# EAGLE design pH (EAGLE 9.5.0)
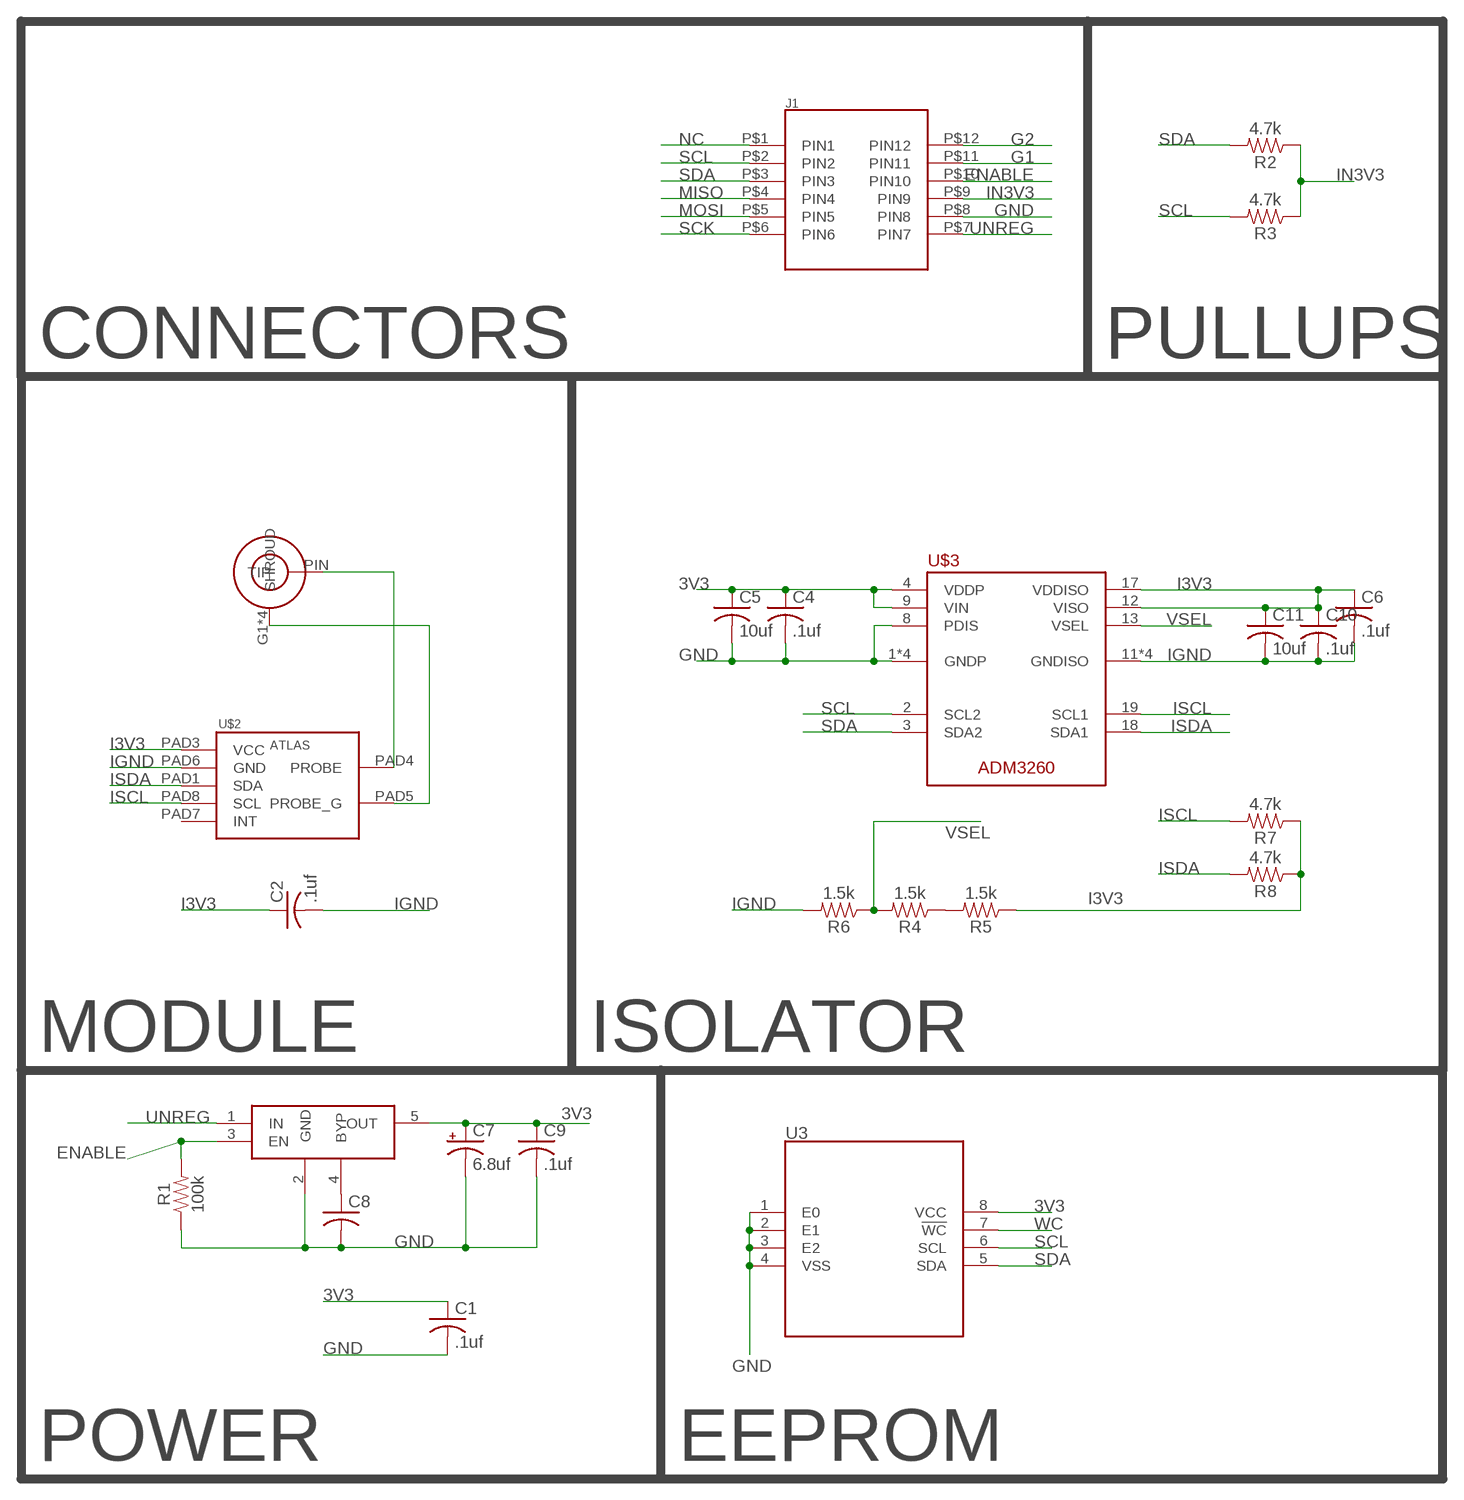
[diagram p0: schematic, sheet 1]

## Parts
C1  .1uf  C-USC0603K  [C0603K]
C2  .1uf  C-USC0603K  [C0603K]
C4  .1uf  C-USC0603K  [C0603K]
C5  10uf  C-USC0603K  [C0603K]
C6  .1uf  C-USC0603K  [C0603K]
C7  6.8uf  CPOL-USA/3216-18R  [A/3216-18R]
C8  C-USC0603K  [C0603K]
C9  .1uf  C-USC0603K  [C0603K]
C10  .1uf  C-USC0603K  [C0603K]
C11  10uf  C-USC0603K  [C0603K]
J1  2X6-HEADERS  [M20-7810645]
R1  100k  100KOHM-0603-1/10W-1%  [0603]
R2  4.7k  100KOHM-0603-1/10W-1%  [0603]
R3  4.7k  100KOHM-0603-1/10W-1%  [0603]
R4  1.5k  100KOHM-0603-1/10W-1%  [0603]
R5  1.5k  100KOHM-0603-1/10W-1%  [0603]
R6  1.5k  100KOHM-0603-1/10W-1%  [0603]
R7  4.7k  100KOHM-0603-1/10W-1%  [0603]
R8  4.7k  100KOHM-0603-1/10W-1%  [0603]
U3  M24C02-WMN6TP  [SOIC127P600X175-8]
U$1  5-1814832-1  [5-1814832-1]
U$2  ATLAS10P  [ATLAS-10P]
U$3  ADM3260  [SOP65P780X200-20]
U$4  MIC5219-3.3YM5-TR  [SOT95P280X145-5]

## Nets
3V3: C1.1 C4.1 C5.1 C7.+ C9.1 U3.8(VCC) U$3.4(VDDP) U$3.9(VIN) U$4.5(OUT)
ENABLE: J1.P$10(PIN10) R1.2 U$4.3(EN)
G1: J1.P$11(PIN11)
G2: J1.P$12(PIN12)
GND: C1.2 C4.2 C5.2 C7.- C8.2 C9.2 J1.P$8(PIN8) R1.1 U3.1(E0) U3.2(E1) U3.3(E2) U3.4(VSS) U$3.1(GNDP) U$3.5(GNDP) U$3.7(GNDP) U$3.8(PDIS) U$3.10(GNDP) U$4.2(GND)
I3V3: C2.1 C6.1 C10.1 C11.1 R5.1 R7.1 R8.1 U$2.PAD3(VCC) U$3.12(VISO) U$3.17(VDDISO)
IGND: C2.2 C6.2 C10.2 C11.2 R6.2 U$2.PAD6(GND) U$3.11(GNDISO) U$3.14(GNDISO) U$3.16(GNDISO) U$3.20(GNDISO)
IN3V3: J1.P$9(PIN9) R2.1 R3.1
ISCL: R7.2 U$2.PAD8(SCL) U$3.19(SCL1)
ISDA: R8.2 U$2.PAD1(SDA) U$3.18(SDA1)
MISO: J1.P$4(PIN4)
MOSI: J1.P$5(PIN5)
N$2: U$1.PIN(TIP) U$2.PAD4(PROBE)
N$3: R4.1 R5.2
N$6: C8.1 U$4.4(BYP)
NC: J1.P$1(PIN1)
PG: U$1.G1(SHROUD) U$1.G2(SHROUD) U$1.G3(SHROUD) U$1.G4(SHROUD) U$2.PAD5(PROBE_G)
SCK: J1.P$6(PIN6)
SCL: J1.P$2(PIN2) R3.2 U3.6(SCL) U$3.2(SCL2)
SDA: J1.P$3(PIN3) R2.2 U3.5(SDA) U$3.3(SDA2)
UNREG: J1.P$7(PIN7) U$4.1(IN)
VSEL: R4.2 R6.1 U$3.13(VSEL)
WC: U3.7(!WC)
Unconnected: U$2.PAD7(INT)

## Notes on the sheet
- CONNECTORS | PULLUPS
- MODULE | ISOLATOR
- POWER | EEPROM

## Library data of the parts
C1 C2 C4-C6 C8-C11 = rcl:C-US: CAPACITOR, American symbol; SPICEPREFIX: C
C7 = rcl:CPOL-US: POLARIZED CAPACITOR, American symbol; SPICEPREFIX: C
J1 = Conservify:2X6-HEADERS
R1 = SparkFun-Resistors:100KOHM: 100kΩ resistor A resistor is a passive two-terminal electrical component that implements electrical resistance as a circuit element. Resistors act to reduce current flow, and, at the same time, act to lower voltage levels within circuits. - Wikipedia; PROD_ID: RES-07828
R2-R8 = SparkFun-Resistors:100KOHM: 100kΩ resistor A resistor is a passive two-terminal electrical component that implements electrical resistance as a circuit element. Resistors act to reduce current flow, and, at the same time, act to lower voltage levels within circuits. - Wikipedia; PROD_ID: RES-07828; VALUE: 100k
U3 = Conservify:M24C02-WMN6TP
U$1 = Conservify:5-1814832-1
U$2 = Conservify:ATLAS10P
U$3 = Conservify:ADM3260
U$4 = Conservify:MIC5219-3.3YM5-TR

## Board
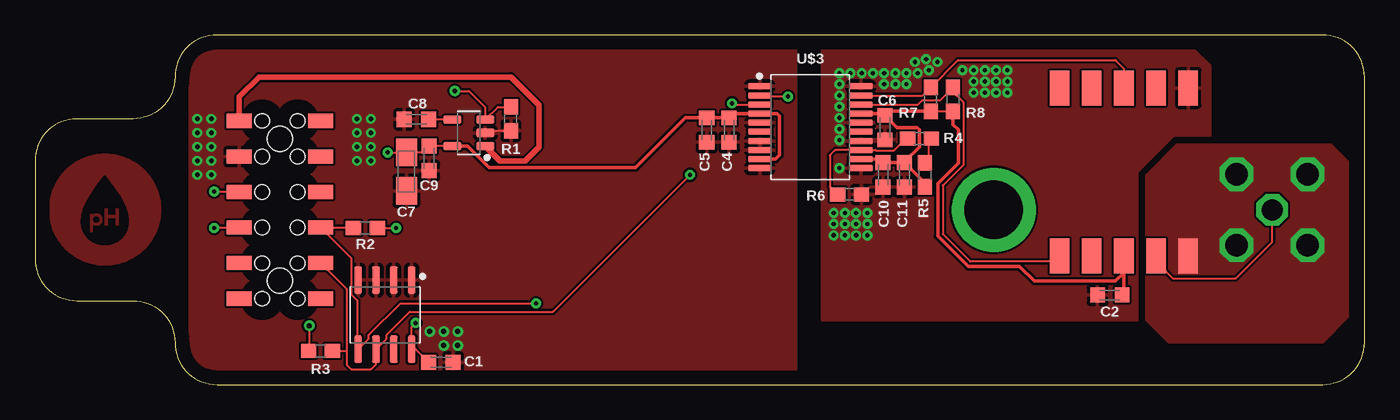
[diagram p1: board, top side]
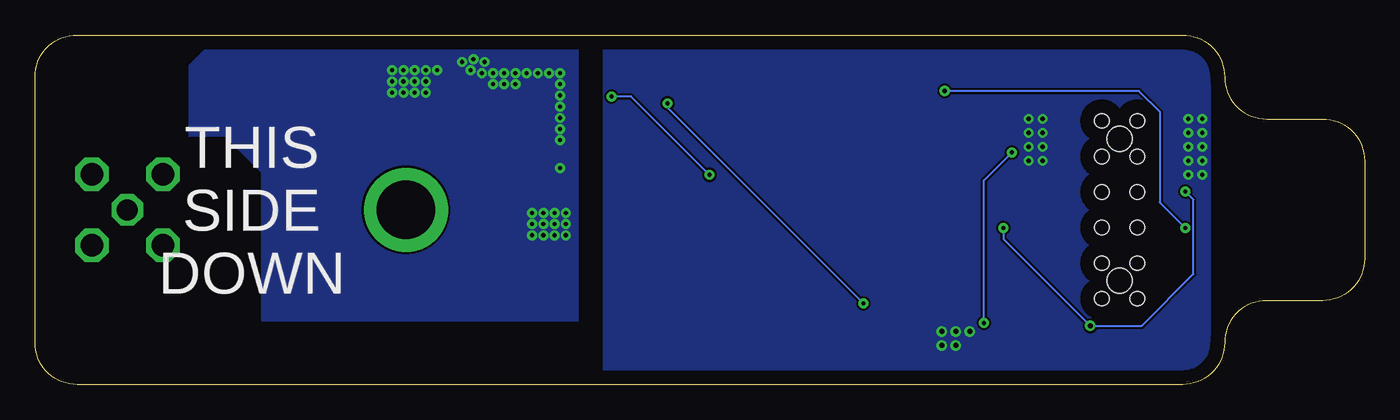
[diagram p2: board, bottom side, seen from below]

Size 95 x 25 mm. Coordinates in mm from the lower left corner, seen from the top.
Outline: 92,0 arc90 95,3 95,22 arc90 92,25 13,25 arc90 10,22 arc-90 7,19 3,19 arc90 0,16 0,9 arc90 3,6 7,6 arc-90 10,3 arc90 13,0 92,0
Copper layers (1*16): Top 0.035mm / dielectric 1.5mm / Bottom 0.035mm
Design rules "default *": minimum track width 6mil, minimum drill 0.3mm, track to track 6mil, track to pad 6mil, pad to pad 6mil, via to via 6mil, smd to smd 6mil, copper to edge 40mil, drill to drill 6mil, minimum pad ring 10mil, minimum via ring 8mil, stop-mask expansion 4mil, vias tented up to drill 0.3mm, thermal gap 10mil

### Footprints (pad centres in the part's own frame; a part is rotated, then mirrored left to right if it is on the bottom)
C0603K = smd 1.05 x 1.08: 1 -0.875,0; 2 0.875,0
A/3216-18R = smd 1.95 x 1.5: + 1.375,0; - -1.375,0
M20-7810645 = smd 1.02 x 1.78: P$1 -6.35,-2.91; P$2 -3.81,-2.91; P$3 -1.27,-2.91; P$4 1.27,-2.91; P$5 3.81,-2.91; P$6 6.35,-2.91; P$7 6.35,2.91; P$8 3.81,2.91; P$9 1.27,2.91; P$10 -1.27,2.91; P$11 -3.81,2.91; P$12 -6.35,2.91 | hole 1.02: -6.35,1.27; -3.81,1.27; -1.27,1.27; 1.27,1.27; 3.81,1.27; 6.35,1.27; 6.35,-1.27; 3.81,-1.27; 1.27,-1.27; -1.27,-1.27; -3.81,-1.27; -6.35,-1.27 | hole 1.8: -5.08,0; 5.08,0
0603 = smd 1.1 x 1: 1 -0.85,0; 2 0.85,0
SOIC127P600X175-8 = smd 1.968 x 0.569: 1 -2.473,1.905; 2 -2.473,0.635; 3 -2.473,-0.635; 4 -2.473,-1.905; 5 2.473,-1.905; 6 2.473,-0.635; 7 2.473,0.635; 8 2.473,1.905
5-1814832-1 = drill 1.6 octagon: G1 -2.54,2.54; G2 -2.54,-2.54; G3 2.54,-2.54; G4 2.54,2.54 | drill 1.5 octagon: PIN 0,0
ATLAS-10P = smd 2.5 x 1.4: PAD1 -6,5; PAD2 -6,2.7; PAD3 -6,0.4; PAD4 -6,-1.9; PAD5 -6,-4.2; PAD6 6,-4.2; PAD7 6,-1.9; PAD8 6,0.4; PAD9 6,2.7; PAD10 6,5
SOP65P780X200-20 = smd 1.702 x 0.475: 1 -3.603,2.925; 2 -3.603,2.275; 3 -3.603,1.625; 4 -3.603,0.975; 5 -3.603,0.325; 6 -3.603,-0.325; 7 -3.603,-0.975; 8 -3.603,-1.625; 9 -3.603,-2.275; 10 -3.603,-2.925; 11 3.603,-2.925; 12 3.603,-2.275; 13 3.603,-1.625; 14 3.603,-0.975; 15 3.603,-0.325; 16 3.603,0.325; 17 3.603,0.975; 18 3.603,1.625; 19 3.603,2.275; 20 3.603,2.925
SOT95P280X145-5 = smd 1.262 x 0.609: 1 -1.175,0.95; 2 -1.175,0; 3 -1.175,-0.95; 4 1.175,-0.95; 5 1.175,0.95

### Placement (x,y rotation side)
C1  29,1.6 0 top
C2  76.8,6.4 180 top
C4  49.6,18.2 270 top
C5  48,18.2 270 top
C6  60.73,18.38 270 top
C7  26.54,15.23 90 top
C8  27.25,18.97 180 top
C9  28.17,16.18 270 top
C10  60.6,15 270 top
C11  62.13,15 270 top
J1  17.5,12.5 90 top
R1  34,19 90 top
R2  23.6,11.2 180 top
R3  20.4,2.4 0 top
R4  63.2,17.6 180 top
R5  63.6,15 90 top
R6  58.2,13.6 0 top
R7  64,20.4 90 top
R8  65.6,20.4 90 top
U3  25,5 270 top
U$1  88.4,12.5 0 top
U$2  78.2,15.2 90 top
U$3  55.4,18.4 0 top
U$4  31,18 180 top

### Tracks (layer width: path | path; a pad name or v marks a point on that pad's centre or on a via)
3V3  (via drill 0.3)
  Top 0.152: 29.95,17.05 U$4.5 C9.1 27.73,16.61 C7.+ v25.21,16.61 v25.2,16.6 | C1.1 27.2,2.53 | 27.2,2.53 27,2.73 | 27.2,2.53 U3.8 26.91,4.11 v27.2,4.4
  Top 0.254: U$3.9 52.92,16.12 53.2,16.4 53.2,19.2 53.02,19.38 U$3.4 49.9,19.38 C4.1 C5.1 46.48,19.07 42.92,15.52 32.45,15.52 30.92,17.05 U$4.5
  Bottom 0.152: v27.2,4.4 27.2,14.6 v25.2,16.6
ENABLE  (via drill 0.3, 0.35)
  Top 0.152: R1.2 33.08,19.85 U$4.3 32.17,19.82 31,21 v30,21 | v12.8,11.2 12.83,11.23 J1.P$10
  Bottom 0.152: v30,21 16.11,21 14.63,19.51 14.63,13.03 v12.8,11.2
GND  (via drill 0.3, 0.35)
  Top 0.152: U$4.2 32.33,18.15 R1.1
  other vias: 23,19 24,19 24,18 23,18 24,17 23,17 24,16 11.6,19 11.6,18 11.6,17 11.6,16 11.6,15 12.6,19 12.6,18 12.6,17 12.6,16 12.6,15 30.2,3.8 28.2,3.8 29.2,3.8 29.2,2.8 30.2,2.8 23,16
  pour Top: 11,24 54.4,24 54.4,1 11,1
  pour Bottom: 11,24 54.4,24 54.4,1 11,1
GND1
  pour Top (rank 3): 5.78,12.6 5.78,12.11 5.19,12.11 5.19,12.6 5,12.6 5,11.38 5.19,11.38 5.19,11.92 5.78,11.92 5.78,11.38 5.97,11.38 5.97,12.6
  pour Top (rank 3): 4.37,11.54 4.34,11.54 4.31,11.55 4.27,11.57 4.23,11.58 4.22,11.6 4.2,11.61 4.18,11.63 4.17,11.65 4.16,11.67 4.15,11.69 4.14,11.72 4.14,11.74 4.13,11.77 4.13,11.8 4.13,11.82 4.14,11.85 4.14,11.88 4.15,11.9 4.16,11.92 4.17,11.95 4.18,11.96 4.21,11.99 4.22,12 4.24,12.02 4.26,12.03 4.29,12.04 4.31,12.05 4.34,12.05 4.38,12.05 4.38,12.23 4.35,12.23 4.31,12.22 4.29,12.22 4.25,12.2 4.22,12.19 4.18,12.17 4.16,12.15 4.13,12.13 4.13,12.21 3.95,12.21 3.95,10.9 4.13,10.9 4.13,11.46 4.17,11.43 4.19,11.41 4.22,11.4 4.25,11.38 4.3,11.37 4.32,11.36 4.34,11.36 4.38,11.36 4.38,11.54
  pour Top (rank 3): 4.82,11.82 4.82,11.86 4.81,11.9 4.8,11.94 4.78,11.98 4.76,12.02 4.74,12.06 4.72,12.09 4.69,12.12 4.66,12.15 4.62,12.17 4.59,12.19 4.55,12.2 4.51,12.22 4.46,12.23 4.42,12.23 4.38,12.23 4.38,12.05 4.43,12.05 4.47,12.04 4.49,12.03 4.51,12.02 4.54,12 4.56,11.98 4.59,11.94 4.6,11.92 4.61,11.9 4.62,11.88 4.62,11.85 4.62,11.82 4.63,11.8 4.62,11.77 4.62,11.74 4.62,11.72 4.61,11.69 4.59,11.65 4.56,11.61 4.54,11.6 4.52,11.58 4.5,11.57 4.48,11.56 4.46,11.55 4.43,11.55 4.4,11.54 4.38,11.54 4.38,11.54 4.38,11.36 4.43,11.36 4.47,11.36 4.52,11.37 4.56,11.39 4.6,11.4 4.63,11.42 4.67,11.45 4.7,11.48 4.74,11.52 4.76,11.56 4.78,11.59 4.79,11.62 4.8,11.66 4.81,11.71 4.82,11.77
  pour Top (rank 3): 9.01,12.71 8.99,12.92 8.97,13.12 8.93,13.31 8.89,13.51 8.83,13.7 8.77,13.88 8.7,14.07 8.62,14.24 8.53,14.42 8.43,14.58 8.33,14.75 8.22,14.9 8.1,15.05 7.97,15.2 7.84,15.34 7.7,15.47 7.55,15.6 7.4,15.72 7.25,15.83 7.08,15.93 6.92,16.03 6.74,16.12 6.57,16.2 6.38,16.27 6.2,16.33 6.01,16.39 5.81,16.43 5.62,16.47 5.42,16.49 5.21,16.51 4.99,16.51 4.99,14.99 5.01,14.99 5.04,14.98 5.06,14.97 5.07,14.95 5.81,13.96 6.08,13.55 6.32,13.13 6.42,12.93 6.51,12.72 6.59,12.51 6.65,12.31 6.67,12.21 6.69,12.11 6.71,12.01 6.72,11.91 6.73,11.82 6.73,11.63 6.73,11.54 6.72,11.45 6.71,11.36 6.7,11.27 6.68,11.19 6.65,11.1 6.62,11.02 6.59,10.94 6.55,10.86 6.51,10.79 6.47,10.72 6.42,10.65 6.37,10.58 6.32,10.52 6.26,10.46 6.2,10.4 6.14,10.34 6.07,10.29 6,10.24 5.93,10.19 5.86,10.15 5.78,10.11 5.7,10.08 5.62,10.05 5.54,10.02 5.45,10 5.36,9.98 5.27,9.96 5.18,9.95 5.09,9.94 4.99,9.94 4.99,8.5 5.21,8.51 5.42,8.52 5.62,8.55 5.81,8.58 6.01,8.63 6.2,8.68 6.38,8.74 6.57,8.82 6.74,8.9 6.92,8.98 7.08,9.08 7.25,9.18 7.4,9.3 7.56,9.42 7.7,9.54 7.84,9.67 7.97,9.81 8.1,9.96 8.22,10.11 8.33,10.27 8.43,10.43 8.53,10.6 8.62,10.77 8.7,10.95 8.77,11.13 8.83,11.31 8.89,11.5 8.93,11.7 8.97,11.9 8.99,12.1 9.01,12.3 9.01,12.51
  pour Top (rank 3): 4.9,9.94 4.8,9.95 4.71,9.96 4.62,9.98 4.53,10 4.45,10.02 4.36,10.05 4.28,10.08 4.2,10.11 4.13,10.15 4.05,10.19 3.98,10.24 3.91,10.29 3.85,10.34 3.78,10.4 3.72,10.45 3.66,10.51 3.61,10.58 3.56,10.64 3.51,10.71 3.47,10.79 3.43,10.86 3.39,10.94 3.36,11.02 3.33,11.1 3.3,11.18 3.28,11.27 3.27,11.35 3.25,11.44 3.25,11.53 3.24,11.63 3.25,11.81 3.26,11.91 3.27,12.01 3.28,12.11 3.3,12.21 3.33,12.31 3.39,12.51 3.47,12.72 3.56,12.92 3.66,13.13 3.89,13.54 4.16,13.96 4.45,14.36 4.91,14.96 4.93,14.97 4.95,14.98 4.97,14.99 4.99,14.99 4.99,16.51 4.99,16.51 4.8,16.51 4.6,16.49 4.4,16.47 4.2,16.43 4,16.39 3.81,16.33 3.63,16.27 3.45,16.2 3.27,16.12 3.1,16.03 2.93,15.93 2.77,15.83 2.61,15.72 2.46,15.6 2.31,15.47 2.17,15.34 2.04,15.2 1.92,15.06 1.8,14.9 1.68,14.75 1.58,14.58 1.48,14.42 1.39,14.24 1.31,14.07 1.24,13.88 1.18,13.7 1.13,13.51 1.08,13.31 1.05,13.12 1.02,12.92 1.01,12.71 1,12.51 1.01,12.3 1.02,12.1 1.05,11.9 1.08,11.7 1.13,11.51 1.18,11.32 1.24,11.13 1.31,10.95 1.39,10.77 1.48,10.6 1.58,10.43 1.68,10.27 1.8,10.11 1.91,9.96 2.04,9.81 2.17,9.67 2.31,9.54 2.46,9.41 2.61,9.3 2.77,9.18 2.93,9.08 3.1,8.98 3.27,8.89 3.45,8.82 3.63,8.74 3.82,8.68 4.01,8.63 4.2,8.58 4.4,8.55 4.6,8.52 4.8,8.51 4.99,8.5 4.99,9.94
I3V3
  Top 0.152: 63.83,19.38 R7.1 R8.1
  Top 0.254: R8.1 65.6,18.6 65.97,18.23 65.97,15.84 64.52,14.38 64.52,10.62 66.69,8.44 70.36,8.44 71.4,7.4 77.2,7.4 77.8,8 U$2.PAD3 77.8,6.53 C2.1 | U$3.12 60.35,16.12 C10.1 C11.1 | C6.1 61.6,18.38 63.02,18.38 63.18,18.22 63.18,16.98 62.13,15.93 C11.1 | C11.1 63.6,14.4 R5.1 | U$3.17 60.61,19.38 C6.1 | C6.1 61.03,19.55 R7.1
IGND  (via drill 0.3)
  other vias: 57.47,15.47 57.47,17.47 57.47,18.27 57.47,19.07 57.47,19.87 57.47,20.67 57.47,21.47 57.07,12.27 57.87,12.27 58.67,12.27 59.47,12.27 57.07,11.47 57.87,11.47 58.67,11.47 57.07,10.67 59.47,11.47 58.27,22.27 59.07,22.27 59.87,22.27 60.67,21.47 61.47,21.47 62.27,21.47 60.67,22.27 61.47,22.27 62.27,22.27 57.47,22.27 63.07,22.27 63.87,22.47 63.67,23.27 64.47,23.07 62.87,23.07 66.27,22.47 67.07,22.47 67.87,22.47 68.67,22.47 69.47,22.47 67.07,21.67 67.87,21.67 68.67,21.67 69.47,21.67 67.07,20.87 67.87,20.87 68.67,20.87 69.47,20.87 57.87,10.67 58.67,10.67 59.47,10.67
  pour Bottom: 56.2,4.6 56.2,24 82.8,24 84,22.8 84,17.8 81.4,17.8 78.8,15.2 78.8,4.6
  pour Top: 84,17.8 84,22.8 82.8,24 56.2,24 56.2,4.6 78.8,4.6 78.8,15.2 81.4,17.8
IN3V3  (via drill 0.3, 0.35)
  Top 0.152: v19.6,4.2 19.6,2.45 R3.1 | R2.1 v25.8,11.2 | v12.8,13.8 14.56,13.8 J1.P$9
  Bottom 0.152: v25.8,11.2 25.8,10.4 v19.6,4.2 15.91,4.2 12.22,7.9 12.22,13.22 v12.8,13.8
ISCL
  Top 0.152: U$3.19 63.42,20.68 R7.2 65.95,23.2 77.2,23.2 77.8,22.6 U$2.PAD8
ISDA
  Top 0.152: U$3.18 63.1,20.02 63.41,20.33 64.68,20.33 R8.2 65.6,20.92 66.33,20.2 66.33,15.7 64.87,14.24 64.87,10.76 66.83,8.8 72.8,8.8 U$2.PAD1
N$1  (via drill 4.2 pad 6)
  other vias: 68.5,12.5
N$2
  Top 0.152: U$2.PAD4 80.1,8.8 81.3,7.6 85.8,7.6 88.4,10.2 U$1.PIN
N$3
  Top 0.152: R4.1 63.85,17.4 63.85,16.1 R5.2
N$6
  Top 0.152: C8.1 29.81,18.97 U$4.4
PG
  pour Top (no thermals): 79.4,4.6 79.4,15 81.6,17.2 92.6,17.2 93.8,16 93.8,4.8 92,3 81,3
SCL  (via drill 0.3)
  Top 0.152: J1.P$2 22.28,6.82 22.28,2.42 | 22.28,2.42 22.28,1.42 22.6,1.1 22.6,1.09 24,1.09 24.37,1.46 U3.6 25.12,3.28 25.12,3.54 26.78,5.2 37,5.2 v46.8,15 | R3.2 22.26,2.4 22.28,2.42 | v53.8,20.6 51.87,20.6 U$3.2
  Bottom 0.152: v46.8,15 52.4,20.6 v53.8,20.6
SDA  (via drill 0.3)
  Top 0.152: R2.2 22.72,11.23 J1.P$3 22.58,9.06 22.58,6.46 23.02,6.02 23.02,2.6 U3.5 23.85,3.28 23.85,3.54 26.11,5.8 v35.8,5.8 | v49.8,20.11 49.88,20.02 U$3.3
  Bottom 0.152: v35.8,5.8 49.8,19.8 v49.8,20.11
UNREG
  Top 0.406: J1.P$7 14.59,20.59 16,22 34,22 36,20 36,17 35,16 33.23,16 U$4.1
VSEL
  Top 0.152: R4.2 62.22,17.6 61.37,16.75 60.1,16.75 60.07,16.77 U$3.13 57.17,16.77 56.8,16.4 56.8,14.15 R6.1

### Text on the board
bPlace: THIS / SIDE / DOWN